# Altium schematic sheet top.SchDoc
size B; SheetNumber: 1
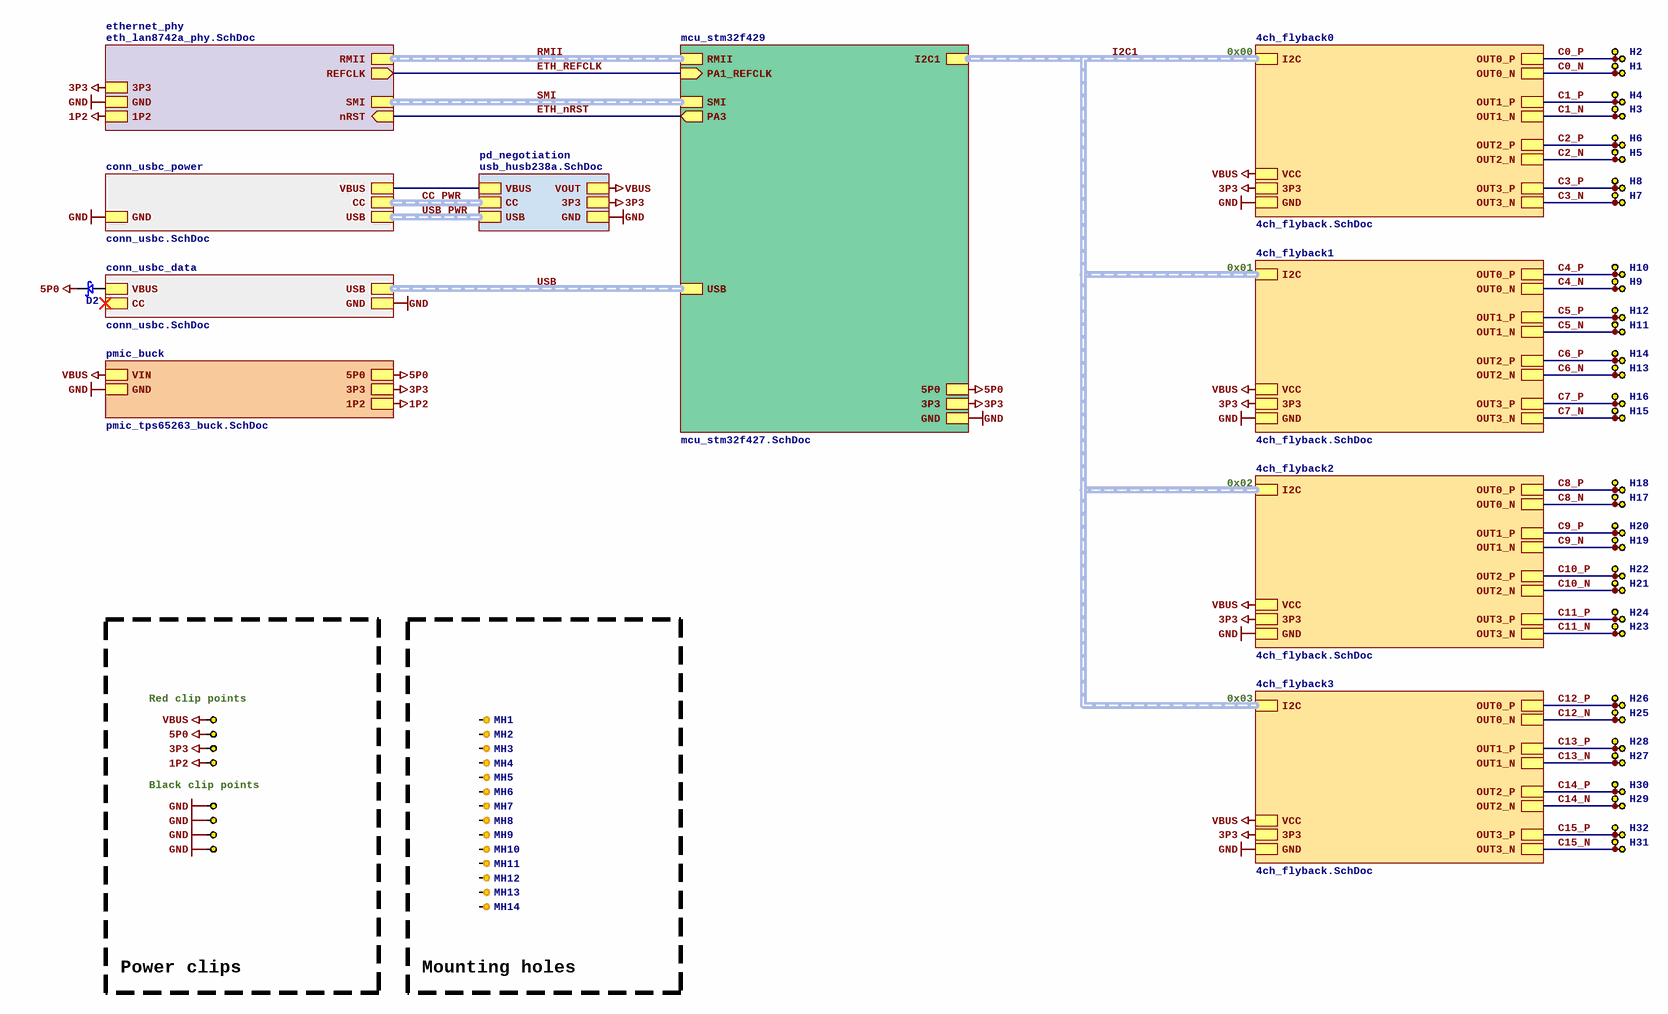
[diagram p0: top.SchDoc]

## Parts
D2  B340A-13-F  [SMA]  (value not drawn)
H1  SMTSO-M2-10ET  [SMTSO-M2-10ET]  (value not drawn)
H2  SMTSO-M2-10ET  [SMTSO-M2-10ET]  (value not drawn)
H3  SMTSO-M2-10ET  [SMTSO-M2-10ET]  (value not drawn)
H4  SMTSO-M2-10ET  [SMTSO-M2-10ET]  (value not drawn)
H5  SMTSO-M2-10ET  [SMTSO-M2-10ET]  (value not drawn)
H6  SMTSO-M2-10ET  [SMTSO-M2-10ET]  (value not drawn)
H7  SMTSO-M2-10ET  [SMTSO-M2-10ET]  (value not drawn)
H8  SMTSO-M2-10ET  [SMTSO-M2-10ET]  (value not drawn)
H9  SMTSO-M2-10ET  [SMTSO-M2-10ET]  (value not drawn)
H10  SMTSO-M2-10ET  [SMTSO-M2-10ET]  (value not drawn)
H11  SMTSO-M2-10ET  [SMTSO-M2-10ET]  (value not drawn)
H12  SMTSO-M2-10ET  [SMTSO-M2-10ET]  (value not drawn)
H13  SMTSO-M2-10ET  [SMTSO-M2-10ET]  (value not drawn)
H14  SMTSO-M2-10ET  [SMTSO-M2-10ET]  (value not drawn)
H15  SMTSO-M2-10ET  [SMTSO-M2-10ET]  (value not drawn)
H16  SMTSO-M2-10ET  [SMTSO-M2-10ET]  (value not drawn)
H17  SMTSO-M2-10ET  [SMTSO-M2-10ET]  (value not drawn)
H18  SMTSO-M2-10ET  [SMTSO-M2-10ET]  (value not drawn)
H19  SMTSO-M2-10ET  [SMTSO-M2-10ET]  (value not drawn)
H20  SMTSO-M2-10ET  [SMTSO-M2-10ET]  (value not drawn)
H21  SMTSO-M2-10ET  [SMTSO-M2-10ET]  (value not drawn)
H22  SMTSO-M2-10ET  [SMTSO-M2-10ET]  (value not drawn)
H23  SMTSO-M2-10ET  [SMTSO-M2-10ET]  (value not drawn)
H24  SMTSO-M2-10ET  [SMTSO-M2-10ET]  (value not drawn)
H25  SMTSO-M2-10ET  [SMTSO-M2-10ET]  (value not drawn)
H26  SMTSO-M2-10ET  [SMTSO-M2-10ET]  (value not drawn)
H27  SMTSO-M2-10ET  [SMTSO-M2-10ET]  (value not drawn)
H28  SMTSO-M2-10ET  [SMTSO-M2-10ET]  (value not drawn)
H29  SMTSO-M2-10ET  [SMTSO-M2-10ET]  (value not drawn)
H30  SMTSO-M2-10ET  [SMTSO-M2-10ET]  (value not drawn)
H31  SMTSO-M2-10ET  [SMTSO-M2-10ET]  (value not drawn)
H32  SMTSO-M2-10ET  [SMTSO-M2-10ET]  (value not drawn)
MH1  HOLE  [HOLE_M3]  (value not drawn)  (no BOM)
MH2  HOLE  [HOLE_M3]  (value not drawn)  (no BOM)
MH3  HOLE  [HOLE_M3]  (value not drawn)  (no BOM)
MH4  HOLE  [HOLE_M3]  (value not drawn)  (no BOM)
MH5  HOLE  [HOLE_M3]  (value not drawn)  (no BOM)
MH6  HOLE  [HOLE_M3]  (value not drawn)  (no BOM)
MH7  HOLE  [HOLE_M3]  (value not drawn)  (no BOM)
MH8  HOLE  [HOLE_M3]  (value not drawn)  (no BOM)
MH9  HOLE  [HOLE_M3]  (value not drawn)  (no BOM)
MH10  HOLE  [HOLE_M3]  (value not drawn)  (no BOM)
MH11  HOLE  [HOLE_M3]  (value not drawn)  (no BOM)
MH12  HOLE  [HOLE_M3]  (value not drawn)  (no BOM)
MH13  HOLE  [HOLE_M3]  (value not drawn)  (no BOM)
MH14  HOLE  [HOLE_M3]  (value not drawn)  (no BOM)
TP3  RH-5000  [TP_RH-5000]  (value not drawn)
TP4  RH-5000  [TP_RH-5000]  (value not drawn)
TP5  RH-5001  [TP_RH-5001]  (value not drawn)
TP6  RH-5000  [TP_RH-5000]  (value not drawn)
TP7  RH-5001  [TP_RH-5001]  (value not drawn)
TP8  RH-5000  [TP_RH-5000]  (value not drawn)
TP9  RH-5001  [TP_RH-5001]  (value not drawn)
TP10  RH-5000  [TP_RH-5000]  (value not drawn)
TP11  RH-5001  [TP_RH-5001]  (value not drawn)
TP12  RH-5000  [TP_RH-5000]  (value not drawn)
TP13  RH-5001  [TP_RH-5001]  (value not drawn)
TP14  RH-5000  [TP_RH-5000]  (value not drawn)
TP15  RH-5001  [TP_RH-5001]  (value not drawn)
TP16  RH-5000  [TP_RH-5000]  (value not drawn)
TP17  RH-5001  [TP_RH-5001]  (value not drawn)
TP18  RH-5000  [TP_RH-5000]  (value not drawn)
TP19  RH-5001  [TP_RH-5001]  (value not drawn)
TP20  RH-5000  [TP_RH-5000]  (value not drawn)
TP21  RH-5001  [TP_RH-5001]  (value not drawn)
TP22  RH-5000  [TP_RH-5000]  (value not drawn)
TP23  RH-5001  [TP_RH-5001]  (value not drawn)
TP24  RH-5000  [TP_RH-5000]  (value not drawn)
TP25  RH-5001  [TP_RH-5001]  (value not drawn)
TP26  RH-5000  [TP_RH-5000]  (value not drawn)
TP27  RH-5001  [TP_RH-5001]  (value not drawn)
TP28  RH-5000  [TP_RH-5000]  (value not drawn)
TP29  RH-5001  [TP_RH-5001]  (value not drawn)
TP30  RH-5000  [TP_RH-5000]  (value not drawn)
TP31  RH-5001  [TP_RH-5001]  (value not drawn)
TP32  RH-5000  [TP_RH-5000]  (value not drawn)
TP33  RH-5000  [TP_RH-5000]  (value not drawn)
TP34  RH-5001  [TP_RH-5001]  (value not drawn)
TP35  RH-5000  [TP_RH-5000]  (value not drawn)
TP36  RH-5000  [TP_RH-5000]  (value not drawn)
TP37  RH-5000  [TP_RH-5000]  (value not drawn)
TP38  RH-5001  [TP_RH-5001]  (value not drawn)
TP39  RH-5001  [TP_RH-5001]  (value not drawn)
TP41  RH-5001  [TP_RH-5001]  (value not drawn)
TP43  RH-5001  [TP_RH-5001]  (value not drawn)
TP45  RH-5001  [TP_RH-5001]  (value not drawn)

## Blocks framed on the sheet
Power clips: TP3 TP33 TP35 TP37 TP39 TP41 TP43 TP45
Mounting holes: MH1-MH14

## Sub-sheets
4ch_flyback0 = 4ch_flyback.SchDoc: GND, 3P3, VCC, I2C (harness I2C), OUT0_P, OUT1_P, OUT2_P, OUT3_P, OUT0_N, OUT1_N, OUT2_N, OUT3_N
4ch_flyback1 = 4ch_flyback.SchDoc: GND, 3P3, VCC, I2C (harness I2C), OUT0_P, OUT1_P, OUT2_P, OUT3_P, OUT0_N, OUT1_N, OUT2_N, OUT3_N
4ch_flyback2 = 4ch_flyback.SchDoc: GND, 3P3, VCC, I2C (harness I2C), OUT0_P, OUT1_P, OUT2_P, OUT3_P, OUT0_N, OUT1_N, OUT2_N, OUT3_N
4ch_flyback3 = 4ch_flyback.SchDoc: GND, 3P3, VCC, I2C (harness I2C), OUT0_P, OUT1_P, OUT2_P, OUT3_P, OUT0_N, OUT1_N, OUT2_N, OUT3_N
conn_usbc_data = conn_usbc.SchDoc: USB (harness DIFF), GND, VBUS, CC (harness CC)
conn_usbc_power = conn_usbc.SchDoc: USB (harness DIFF), GND, VBUS, CC (harness CC)
ethernet_phy = eth_lan8742a_phy.SchDoc: 3P3, GND, REFCLK (out), RMII (harness RMII), nRST (in), SMI (harness SMI), 1P2
mcu_stm32f429 = mcu_stm32f427.SchDoc: GND, 3P3, PA1_REFCLK (in), RMII (harness RMII), SMI (harness SMI), 5P0, USB (harness DIFF), I2C1 (harness I2C), PA3 (out)
pd_negotiation = usb_husb238a.SchDoc: CC (harness CC), GND, 3P3, VBUS, VOUT, USB (harness DIFF)
pmic_buck = pmic_tps65263_buck.SchDoc: 5P0, 3P3, GND, VIN, 1P2

## Nets
1P2: TP37.1 ; sheet ethernet_phy/1P2, sheet pmic_buck/1P2
3P3: TP35.1 ; sheet mcu_stm32f429/3P3, sheet pd_negotiation/3P3, sheet ethernet_phy/3P3, sheet 4ch_flyback0/3P3, sheet 4ch_flyback1/3P3, sheet 4ch_flyback2/3P3, sheet 4ch_flyback3/3P3, sheet pmic_buck/3P3
5P0: D2.2 TP33.1 ; sheet mcu_stm32f429/5P0, sheet pmic_buck/5P0
GND: TP39.1 TP41.1 TP43.1 TP45.1 ; sheet mcu_stm32f429/GND, sheet conn_usbc_power/GND, sheet pd_negotiation/GND, sheet ethernet_phy/GND, sheet 4ch_flyback0/GND, sheet 4ch_flyback1/GND, sheet 4ch_flyback2/GND, sheet 4ch_flyback3/GND, sheet pmic_buck/GND, sheet conn_usbc_data/GND
VBUS: TP3.1 ; sheet pd_negotiation/VOUT, sheet 4ch_flyback0/VCC, sheet 4ch_flyback1/VCC, sheet 4ch_flyback2/VCC, sheet 4ch_flyback3/VCC, sheet pmic_buck/VIN
C0_N: H1.1 TP5.1 ; sheet 4ch_flyback0/OUT0_N
C0_P: H2.1 TP4.1 ; sheet 4ch_flyback0/OUT0_P
C1_N: H3.1 TP7.1 ; sheet 4ch_flyback0/OUT1_N
C1_P: H4.1 TP6.1 ; sheet 4ch_flyback0/OUT1_P
C2_N: H5.1 TP9.1 ; sheet 4ch_flyback0/OUT2_N
C2_P: H6.1 TP8.1 ; sheet 4ch_flyback0/OUT2_P
C3_N: H7.1 TP11.1 ; sheet 4ch_flyback0/OUT3_N
C3_P: H8.1 TP10.1 ; sheet 4ch_flyback0/OUT3_P
C4_N: H9.1 TP13.1 ; sheet 4ch_flyback1/OUT0_N
C4_P: H10.1 TP12.1 ; sheet 4ch_flyback1/OUT0_P
C5_N: H11.1 TP15.1 ; sheet 4ch_flyback1/OUT1_N
C5_P: H12.1 TP14.1 ; sheet 4ch_flyback1/OUT1_P
C6_N: H13.1 TP17.1 ; sheet 4ch_flyback1/OUT2_N
C6_P: H14.1 TP16.1 ; sheet 4ch_flyback1/OUT2_P
C7_N: H15.1 TP19.1 ; sheet 4ch_flyback1/OUT3_N
C7_P: H16.1 TP18.1 ; sheet 4ch_flyback1/OUT3_P
C8_N: H17.1 TP21.1 ; sheet 4ch_flyback2/OUT0_N
C8_P: H18.1 TP20.1 ; sheet 4ch_flyback2/OUT0_P
C9_N: H19.1 TP23.1 ; sheet 4ch_flyback2/OUT1_N
C9_P: H20.1 TP22.1 ; sheet 4ch_flyback2/OUT1_P
C10_N: H21.1 TP25.1 ; sheet 4ch_flyback2/OUT2_N
C10_P: H22.1 TP24.1 ; sheet 4ch_flyback2/OUT2_P
C11_N: H23.1 TP27.1 ; sheet 4ch_flyback2/OUT3_N
C11_P: H24.1 TP26.1 ; sheet 4ch_flyback2/OUT3_P
C12_N: H25.1 TP29.1 ; sheet 4ch_flyback3/OUT0_N
C12_P: H26.1 TP28.1 ; sheet 4ch_flyback3/OUT0_P
C13_N: H27.1 TP31.1 ; sheet 4ch_flyback3/OUT1_N
C13_P: H28.1 TP30.1 ; sheet 4ch_flyback3/OUT1_P
C14_N: H29.1 TP34.1 ; sheet 4ch_flyback3/OUT2_N
C14_P: H30.1 TP32.1 ; sheet 4ch_flyback3/OUT2_P
C15_N: H31.1 TP38.1 ; sheet 4ch_flyback3/OUT3_N
C15_P: H32.1 TP36.1 ; sheet 4ch_flyback3/OUT3_P
ETH_nRST: sheet mcu_stm32f429/PA3, sheet ethernet_phy/nRST
ETH_REFCLK: sheet mcu_stm32f429/PA1_REFCLK, sheet ethernet_phy/REFCLK
NetD2_1: D2.1 ; sheet conn_usbc_data/VBUS
(unnamed): sheet conn_usbc_power/VBUS, sheet pd_negotiation/VBUS

Not connected (* = marked no-connect by the designer): MH1 1; MH2 1; MH3 1; MH4 1; MH5 1; MH6 1; MH7 1; MH8 1; MH9 1; MH10 1; MH11 1; MH12 1; MH13 1; MH14 1

## Buses and harness runs
harness CC_PWR = sheet conn_usbc_power/CC = sheet pd_negotiation/CC
harness I2C1 = sheet 4ch_flyback0/I2C = sheet 4ch_flyback1/I2C = sheet 4ch_flyback2/I2C = sheet 4ch_flyback3/I2C = sheet mcu_stm32f429/I2C1
harness RMII = sheet ethernet_phy/RMII = sheet mcu_stm32f429/RMII
harness SMI = sheet ethernet_phy/SMI = sheet mcu_stm32f429/SMI
harness USB = sheet conn_usbc_data/USB = sheet mcu_stm32f429/USB
harness USB_PWR = sheet conn_usbc_power/USB = sheet pd_negotiation/USB

## Notes on the sheet
- 0x00
- 0x01
- 0x02
- (near TP3) Red clip points
- 0x03
- Black clip points

## Library data of the parts
D2 = SCHOTTKY_B340A-13-F: Rectifier Diode, Schottky, 1 Phase, 1 Element, 3A, 40V V(RRM), Silicon; Manufacturer: Diodes; Supplier 1: Digikey; ComponentLink1URL: https://www.diodes.com/assets/Datasheets/ds30891.pdf; Supplier Part Number 1: B340A-FDICT-ND; Manufacturer Part Number: B340A-13-F; ComponentLink1Description: Datasheet; Supplier 2: LCSC; Supplier Part Number 2: C85098
H1-H32 = STANDOFF_SMTSO-M2-10ET: Standoff M2 x 0.4, electro-Plated Tin, ASTM B545, Class A with Clear Preservative Coating, Annealed, Internal, ASME B1.13M, 6H; Manufacturer 1: PennEngineering; Manufacturer Part Number: SMTSO-M2-10ET; ComponentLink1Description: Catalog; ComponentLink1URL: https://www.pemnet.com/wp-content/uploads/sites/2/2022/06/kdata.pdf; Supplier 1: Mouser; Supplier Part Number 1: 153-SMTSO-M2-10ET; Supplier 2: LCSC; Supplier Part Number 2: C2928171
TP3 TP4 TP6 TP8 TP10 TP12 TP14 TP16 TP18 TP20 TP22 TP24 TP26 TP28 TP30 TP32 TP33 TP35-TP37 = RH-5000: Manufacturer: ronghe; ComponentLink1Description: Datasheet; ComponentLink1URL: https://datasheet.lcsc.com/lcsc/2307040929_ronghe-RH-5000_C5277086.pdf; Manufacturer Part Number: RH-5000; Supplier 2: LCSC; Supplier Part Number 2: C5277086
TP5 TP7 TP9 TP11 TP13 TP15 TP17 TP19 TP21 TP23 TP25 TP27 TP29 TP31 TP34 TP38 TP39 TP41 TP43 TP45 = RH-5001: Manufacturer: ronghe; ComponentLink1Description: Datasheet; ComponentLink1URL: https://datasheet.lcsc.com/lcsc/2307040929_ronghe-RH-5000_C5277086.pdf; Manufacturer Part Number: RH-5001; Supplier 2: LCSC; Supplier Part Number 2: C5199801